# Altium schematic sheet Schematic.SchDoc
size 508 x 330 mm; SheetNumber: 1; SheetTotal: 1
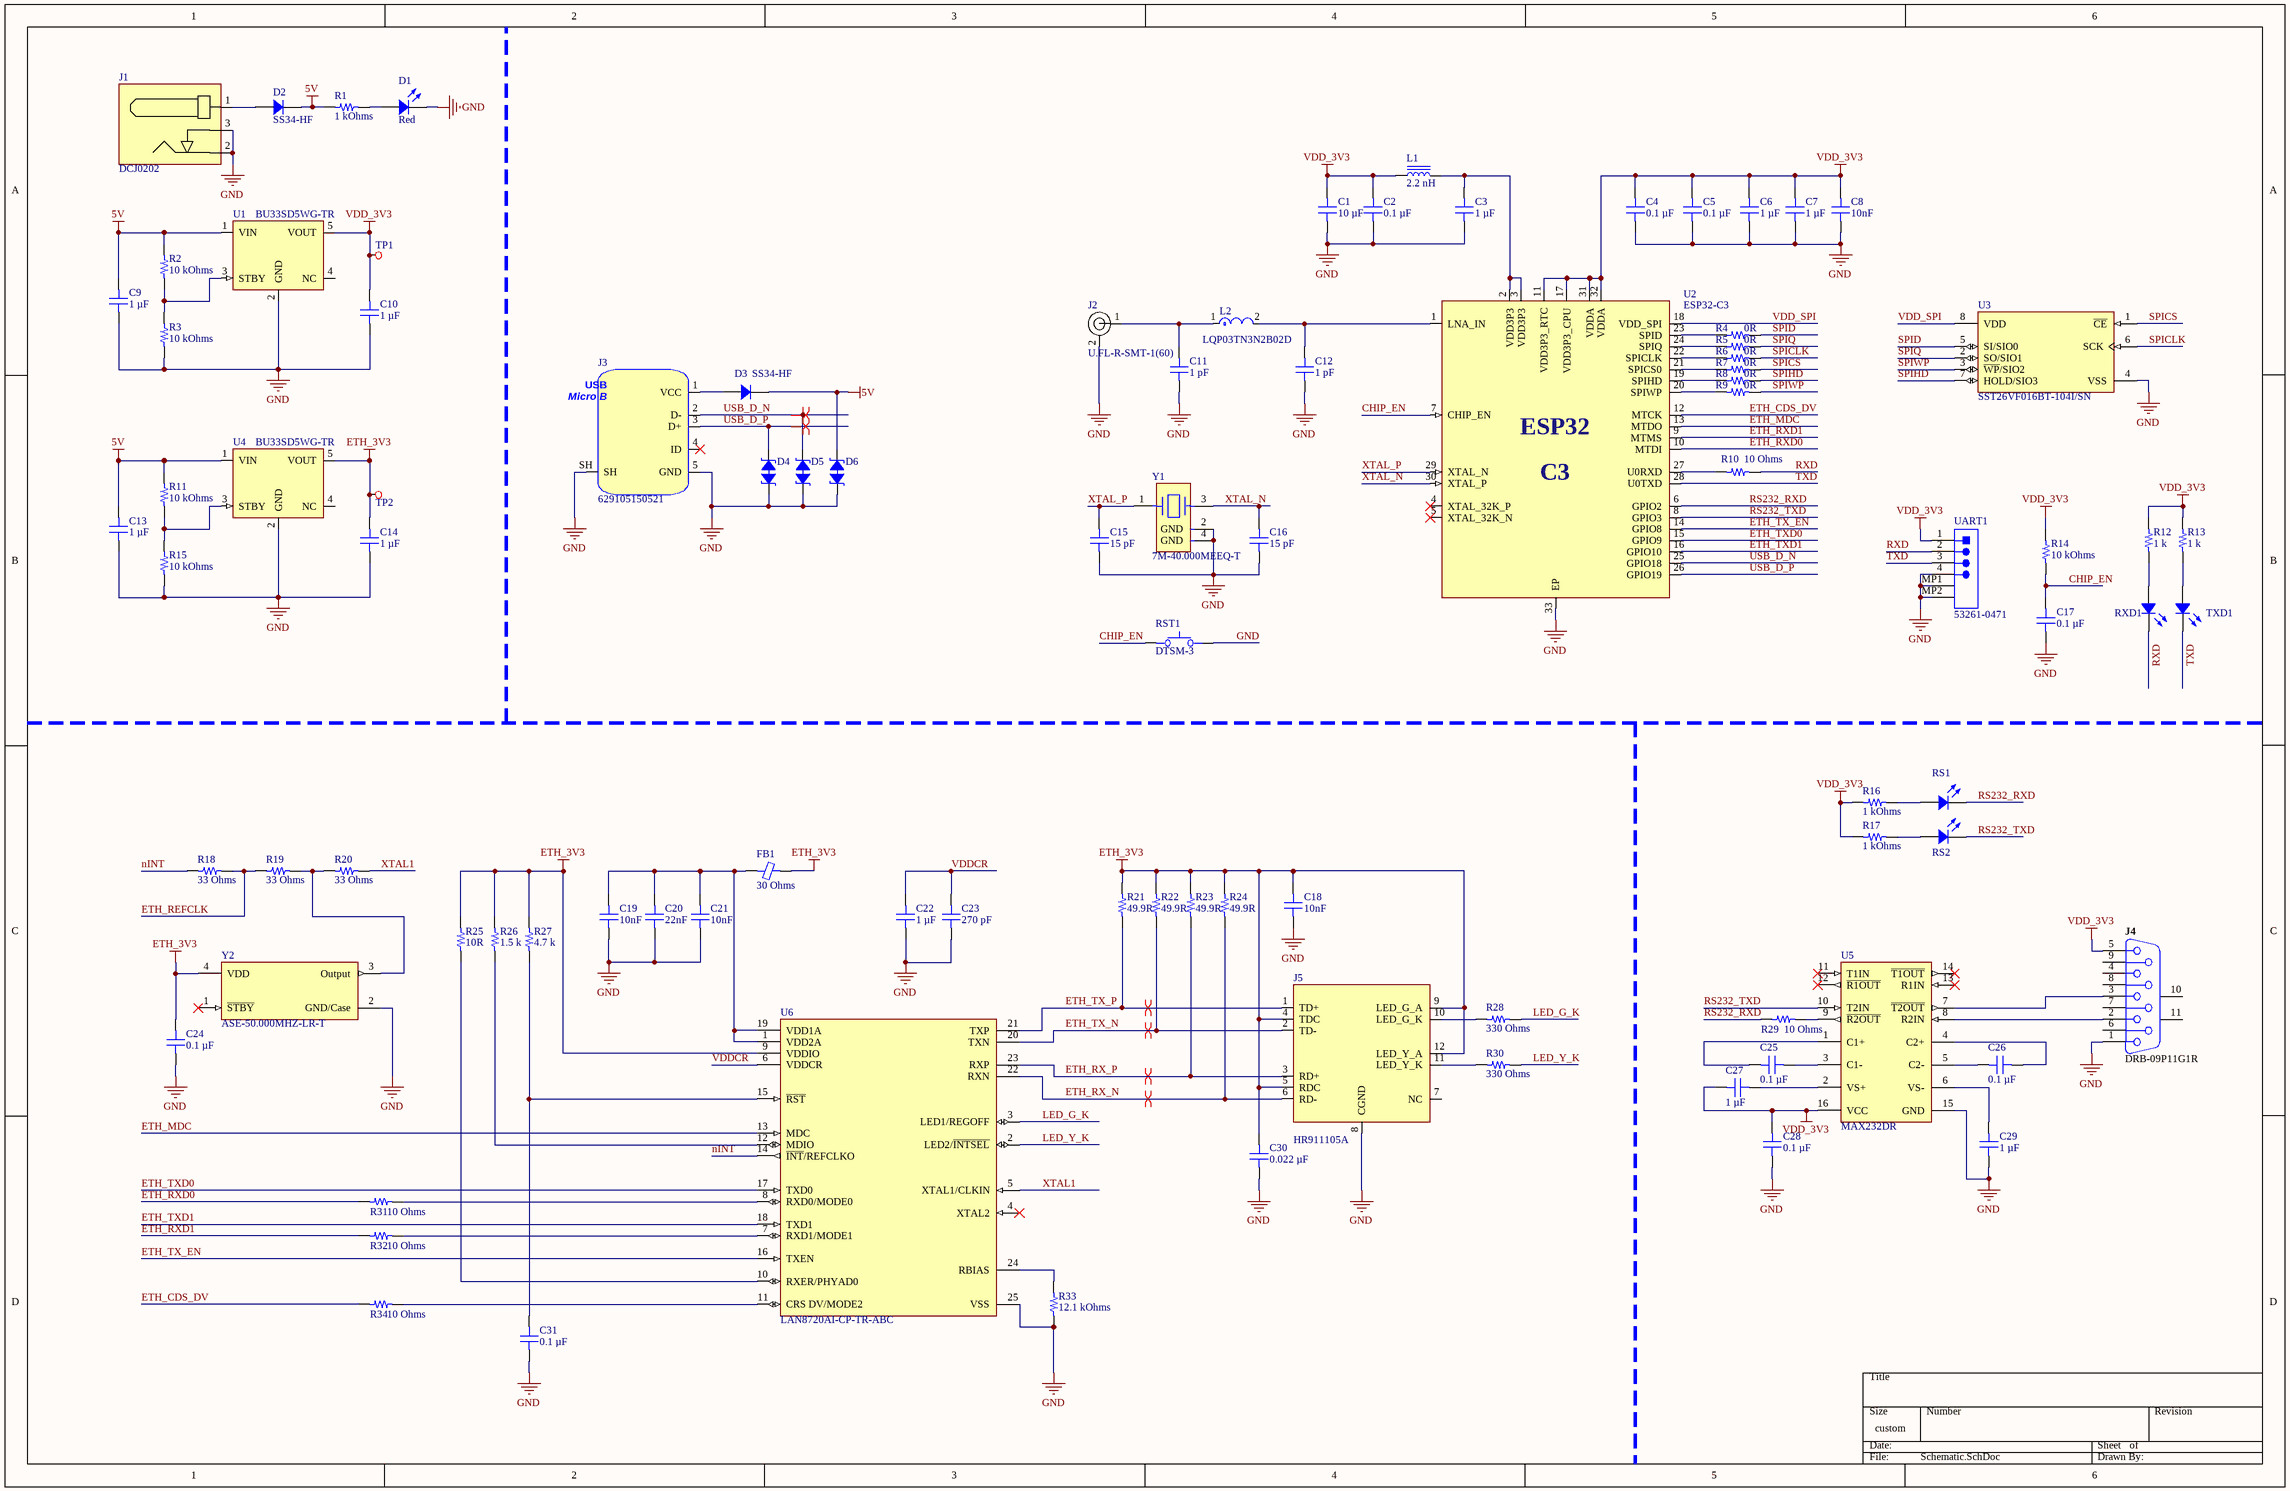
[diagram p0: Schematic.SchDoc]

## Parts
C1  10 µF  [CAP 0402_1005]
C2  0.1 µF  [CAP 0402_1005]
C3  1 µF  [MURATA GRM155 0402_1005]
C4  0.1 µF  [CAP 0402_1005]
C5  0.1 µF  [CAP 0402_1005]
C6  1 µF  [MURATA GRM155 0402_1005]
C7  1 µF  [MURATA GRM155 0402_1005]
C8  Capacitance: 10nF  [CAP 0402_1005]  (hidden comment: 10000 pF)
C9  1 µF  [MURATA GRM155 0402_1005]
C10  1 µF  [MURATA GRM155 0402_1005]
C11  1 pF  [CAP 0201_0603]
C12  1 pF  [CAP 0201_0603]
C13  1 µF  [MURATA GRM155 0402_1005]
C14  1 µF  [MURATA GRM155 0402_1005]
C15  15 pF  [CAP 0402_1005]
C16  15 pF  [CAP 0402_1005]
C17  0.1 µF  [CAP 0402_1005]
C18  Capacitance: 10nF  [CAP 0402_1005]  (hidden comment: 10000 pF)
C19  Capacitance: 10nF  [CAP 0402_1005]  (hidden comment: 10000 pF)
C20  Capacitance: 22nF  [CAP 0402_1005]  (hidden comment: 0.022 µF)
C21  Capacitance: 10nF  [CAP 0402_1005]  (hidden comment: 10000 pF)
C22  1 µF  [MURATA GRM155 0402_1005]
C23  270 pF  [CAP 0402_1005]
C24  0.1 µF  [CAP 0402_1005]
C25  0.1 µF  [CAP 0402_1005]
C26  0.1 µF  [CAP 0402_1005]
C27  1 µF  [MURATA GRM155 0402_1005]
C28  0.1 µF  [CAP 0402_1005]
C29  1 µF  [MURATA GRM155 0402_1005]
C30  0.022 µF  [CAP 0402_1005]
C31  0.1 µF  [CAP 0402_1005]
D1  Red  [LED 0603_1608 RED]
D2  SS34-HF  [DO214AC SMA]
D3  SS34-HF  [DO214AC SMA]
D4  SD05C-TP  [MCC SOD-323]  (value not drawn)
D5  SD05C-TP  [MCC SOD-323]  (value not drawn)
D6  SD05C-TP  [MCC SOD-323]  (value not drawn)
FB1  30 Ohms  [FER 0402_1005]
J1  DCJ0202  [DCJ0202]
J2  U.FL-R-SMT-1(60)  [U.FL-R-SMT-1(60)]
J3  629105150521  [629105150521]
J4  DRB-09P11G1R  [DB9_MALE]
J5  HR911105A  [HR911105A]
L1  2.2 nH  [IND 0402_1005]
L2  LQP03TN3N2B02D  [FP-LQP03TG_02-IPC_B]
R1  1 kOhms  [YAGEO RES 0402_1005]
R2  10 kOhms  [RES 0603_1608]
R3  10 kOhms  [RES 0603_1608]
R4  0R  [RES 0402_1005]
R5  0R  [RES 0402_1005]
R6  0R  [RES 0402_1005]
R7  0R  [RES 0402_1005]
R8  0R  [RES 0402_1005]
R9  0R  [RES 0402_1005]
R10  10 Ohms  [RES 0402_1005]
R11  10 kOhms  [RES 0603_1608]
R12  1 k  [RES 0402_1005]
R13  1 k  [RES 0402_1005]
R14  10 kOhms  [RES 0402_1005]
R15  10 kOhms  [RES 0603_1608]
R16  1 kOhms  [RES 0402_1005]
R17  1 kOhms  [RES 0402_1005]
R18  33 Ohms  [RES 0402_1005]
R19  33 Ohms  [RES 0402_1005]
R20  33 Ohms  [RES 0402_1005]
R21  49.9R  [RES 0402_1005]
R22  49.9R  [RES 0402_1005]
R23  49.9R  [RES 0402_1005]
R24  49.9R  [RES 0402_1005]
R25  10R  [RES 0402_1005]
R26  1.5 k  [RES 0402_1005]
R27  4.7 k  [YAGEO RES 0402_1005]
R28  330 Ohms  [RES 0402_1005]
R29  10 Ohms  [RES 0402_1005]
R30  330 Ohms  [RES 0402_1005]
R31  10 Ohms  [RES 0402_1005]
R32  10 Ohms  [RES 0402_1005]
R33  12.1 kOhms  [RES 0402_1005]
R34  10 Ohms  [RES 0402_1005]
RS1  Green  [LED 0603_1608 GREEN]  (value not drawn)
RS2  Yellow  [LED 0603_1608 YELLOW]  (value not drawn)
RST1  DTSM-3  [DTSM-3]
RXD1  Yellow  [LED 0603_1608 YELLOW]  (value not drawn)
TP1  TEST_POINT_PAD1MM  [ROUND_1MM]  (value not drawn)  (no BOM)
TP2  TEST_POINT_PAD1MM  [ROUND_1MM]  (value not drawn)  (no BOM)
TXD1  Green  [LED 0603_1608 GREEN]  (value not drawn)
U1  BU33SD5WG-TR  [SOT-23-5]
U2  ESP32-C3  [QFN32-5x5]
U3  SST26VF016BT-104I/SN  [FP-C04-057-SN-IPC_B]
U4  BU33SD5WG-TR  [SOT-23-5]
U5  MAX232DR  [D0016A_N]
U6  LAN8720AI-CP-TR-ABC  [FP-24-S4QFN-4x4B-0_5P-IPC_C]
UART1  53261-0471  [MOLEX-53261-0471_V]
Y1  7M-40.000MEEQ-T  [FP-7M-MFG]
Y2  ASE-50.000MHZ-LR-T  [FP-ASE-MFG]

## Nets
5V: C9.2 C13.2 D2.2 D3.2 D6.2 R1.1 R2.2 R11.2 U1.1(VIN) U4.1(VIN)
ETH_3V3: C14.2 C18.2 C24.2 C30.2 FB1.2 J5.4(TDC) J5.5(RDC) J5.9(LED_G_A) J5.12(LED_Y_A) R21.2 R22.2 R23.2 R24.2 R25.2 R26.2 R27.2 TP2.1 U4.5(VOUT) U6.9(VDDIO) Y2.4(VDD)
GND: C1.1 C2.1 C3.1 C4.1 C5.1 C6.1 C7.1 C8.1 C9.1 C10.1 C11.1 C12.1 C13.1 C14.1 C15.1 C16.1 C17.1 C18.1 C19.1 C20.1 C21.1 C22.1 C23.1 C24.1 C28.2 C29.2 C30.1 C31.1 D1.2 D4.1 D5.1 D6.1 J1.2 J1.3 J2.2 J3.5(GND) J3.SH J4.1 J5.8(CGND) R3.1 R15.1 R33.1 RST1.2 U1.2(GND) U2.33(EP) U3.4(VSS) U4.2(GND) U5.15(GND) U6.25(VSS) UART1.4 UART1.MP1 UART1.MP2 Y1.2(GND) Y1.4(GND) Y2.2(GND/Case)
VDD_3V3: C1.2 C2.2 C4.2 C5.2 C6.2 C7.2 C8.2 C10.2 C27.2 C28.1 J4.5 L1.1 R12.1 R13.1 R14.2 R16.1 R17.1 TP1.1 U1.5(VOUT) U2.11(VDD3P3_RTC) U2.17(VDD3P3_CPU) U2.31(VDDA) U2.32(VDDA) U5.16(VCC) UART1.1
CHIP_EN: C17.2 R14.1 RST1.1 U2.7(CHIP_EN)
ETH_CDS_DV: R34.1 U2.12(MTCK)
ETH_MDC: U2.13(MTDO) U6.13(MDC)
ETH_REFCLK: R18.2 R19.1
ETH_RX_N: J5.6(RD-) R24.1 U6.22(RXN)
ETH_RX_P: J5.3(RD+) R23.1 U6.23(RXP)
ETH_RXD0: R31.1 U2.10(MTDI)
ETH_RXD1: R32.1 U2.9(MTMS)
ETH_TX_EN: U2.14(GPIO8) U6.16(TXEN)
ETH_TX_N: J5.2(TD-) R22.1 U6.20(TXN)
ETH_TX_P: J5.1(TD+) R21.1 U6.21(TXP)
ETH_TXD0: U2.15(GPIO9) U6.17(TXD0)
ETH_TXD1: U2.16(GPIO10) U6.18(TXD1)
LED_G_K: R28.2 U6.3(LED1/REGOFF)
LED_Y_K: R30.2 U6.2(LED2/~{INTSEL})
nINT: R18.1 U6.14(~{INT}/REFCLKO)
RS232_RXD: R29.1 RS1.2 U2.6(GPIO2)
RS232_TXD: RS2.2 U2.8(GPIO3) U5.10(T2IN)
RXD: R10.2 RXD1.2 UART1.2
SPICLK: R6.2 U3.6(SCK)
SPICS: R7.2 U3.1(~{CE})
SPID: R4.2 U3.5(SI/SIO0)
SPIHD: R8.2 U3.7(HOLD/SIO3)
SPIQ: R5.2 U3.2(SO/SIO1)
SPIWP: R9.2 U3.3(~{WP}/SIO2)
TXD: TXD1.2 U2.28(U0TXD) UART1.3
USB_D_N: D5.2 J3.2(D-) U2.25(GPIO18)
USB_D_P: D4.2 J3.3(D+) U2.26(GPIO19)
VDD_SPI: U2.18(VDD_SPI) U3.8(VDD)
VDDCR: C22.2 C23.2 U6.6(VDDCR)
XTAL1: R20.2 U6.5(XTAL1/CLKIN)
XTAL_N: C16.2 U2.30(XTAL_P) Y1.3
XTAL_P: C15.2 U2.29(XTAL_N) Y1.1
NetC3_2: C3.2 L1.2 U2.2(VDD3P3) U2.3(VDD3P3)
NetC11_2: C11.2 J2.1 L2.1
NetC12_2: C12.2 L2.2 U2.1(LNA_IN)
NetC19_2: C19.2 C20.2 C21.2 FB1.1 U6.1(VDD2A) U6.19(VDD1A)
NetC25_1: C25.1 U5.3(C1-)
NetC25_2: C25.2 U5.1(C1+)
NetC26_1: C26.1 U5.4(C2+)
NetC26_2: C26.2 U5.5(C2-)
NetC27_1: C27.1 U5.2(VS+)
NetC29_1: C29.1 U5.6(VS-)
NetC31_2: C31.2 R27.1 U6.15(~{RST})
NetD1_1: D1.1 R1.2
NetD2_1: D2.1 J1.1
NetD3_1: D3.1 J3.1(VCC)
NetJ4_2: J4.2 U5.8(R2IN)
NetJ4_3: J4.3 U5.7(~{T2OUT})
NetJ5_10: J5.10(LED_G_K) R28.1
NetJ5_11: J5.11(LED_Y_K) R30.1
NetR2_1: R2.1 R3.2 U1.3(STBY)
NetR4_1: R4.1 U2.23(SPID)
NetR5_1: R5.1 U2.24(SPIQ)
NetR6_1: R6.1 U2.22(SPICLK)
NetR7_1: R7.1 U2.21(SPICS0)
NetR8_1: R8.1 U2.19(SPIHD)
NetR9_1: R9.1 U2.20(SPIWP)
NetR10_1: R10.1 U2.27(U0RXD)
NetR11_1: R11.1 R15.2 U4.3(STBY)
NetR12_2: R12.2 RXD1.1
NetR13_2: R13.2 TXD1.1
NetR16_2: R16.2 RS1.1
NetR17_2: R17.2 RS2.1
NetR19_2: R19.2 R20.1 Y2.3(Output)
NetR25_1: R25.1 U6.10(RXER/PHYAD0)
NetR26_1: R26.1 U6.12(MDIO)
NetR29_2: R29.2 U5.9(~{R2OUT})
NetR31_2: R31.2 U6.8(RXD0/MODE0)
NetR32_2: R32.2 U6.7(RXD1/MODE1)
NetR33_2: R33.2 U6.24(RBIAS)
NetR34_2: R34.2 U6.11(CRS_DV/MODE2)

Not connected (* = marked no-connect by the designer): J3 4(ID)*; J4 4 6 7 8 9 10(MH1) 11(MH2); J5 7(NC); U1 4(NC); U2 4(XTAL_32K_P)* 5(XTAL_32K_N)*; U4 4(NC); U5 11(T1IN)* 12(~{R1OUT})* 13(R1IN)* 14(~{T1OUT})*; U6 4(XTAL2)*; Y2 1(~{STBY})*

## Layout directives
differential pair; differential pair class DIFF100: ETH_RX_N, ETH_RX_P, ETH_TX_N, ETH_TX_P
differential pair; differential pair class DIFF90: USB_D_N, USB_D_P

## Notes on the sheet
- (in symbol 629105150521) USB; Micro B
- (in symbol ESP32-C3) ESP32; C3

## Library data of the parts
C1 = CL05A106MP5NUNC: CAP CER 10UF 10V X5R 0402; manufacturer: Samsung Electro-Mechanics; Tolerance: ±20%; Part Number: CL05A106MP5NUNC; Capacitance: 10 µF; Applications: General Purpose; componentlink1description: Datasheet; componentlink1url: http://www.samsungsem.com/kr/support/product-search/mlcc/CL05A106MP5NUNC.jsp; componentlink2description: DigiKey Link; componentlink2url: https://www.digikey.com/en/products/detail/samsung-electro-mechanics/CL05A106MP5NUNC/3887108; Device Package: 0402 (1005 Metric); lastupdated: 2/9/2024 8:04:38 PM; Lifecycle Status: Active; Minimum Order: 1; Mounting Type: Surface Mount, MLCC; Operating Temperature: -55°C ~ 85°C; Package / Case: 0402 (1005 Metric); packaging: TapeAndReel; partid: 1762; Part Status: Active; price: 0.02; series: CL; Size / Dimension: 0.039" L x 0.020" W (1.00mm x 0.50mm); Supplier 1: DigiKey; Supplier Part Number 1: 1276-1450-1-ND; Temperature Coefficient: X5R; Thickness (Max): 0.028" (0.70mm); value: 10 µF; Voltage - Rated: 10V
C2 C4 C5 C17 C24-C26 C28 C31 = CC0402MRX5R5BB104: CAP CER 0.1UF 6.3V X5R 0402; manufacturer: Yageo; Tolerance: ±20%; Part Number: CC0402MRX5R5BB104; Capacitance: 0.1 µF; Applications: General Purpose; componentlink1description: Datasheet; componentlink1url: https://www.yageo.com/upload/media/product/productsearch/datasheet/mlcc/UPY-GPHC_X5R_4V-to-50V_25.pdf; componentlink2description: DigiKey Link; componentlink2url: https://www.digikey.com/en/products/detail/yageo/CC0402MRX5R5BB104/5883384; Device Package: 0402 (1005 Metric); lastupdated: 2/9/2024 8:04:37 PM; Lifecycle Status: Active; Minimum Order: 10; Mounting Type: Surface Mount, MLCC; Operating Temperature: -55°C ~ 85°C; Package / Case: 0402 (1005 Metric); packaging: CutTape; partid: 1960; Part Status: Active; price: 0.01; series: CC; Size / Dimension: 0.039" L x 0.020" W (1.00mm x 0.50mm); Supplier 1: DigiKey; Supplier Part Number 1: 311-3818-1-ND; Temperature Coefficient: X5R; Thickness (Max): 0.022" (0.55mm); value: 0.1 µF; Voltage - Rated: 6.3V
C3 C6 C7 C9 C10 C13 C14 C22 C27 C29 = GRM155C71A105KE11D: CAP CER 1UF 10V X7S 0402; manufacturer: Murata Electronics; Tolerance: ±10%; Part Number: GRM155C71A105KE11D; Capacitance: 1 µF; Applications: General Purpose; componentlink1description: Datasheet; componentlink1url: https://search.murata.co.jp/Ceramy/image/img/A01X/G101/ENG/GRM155C71A105KE11-01.pdf; componentlink2description: DigiKey Link; componentlink2url: https://www.digikey.com/en/products/detail/murata-electronics/GRM155C71A105KE11D/6606086; Device Package: 0402 (1005 Metric); lastupdated: 8/27/2024 12:42:54 PM; Lifecycle Status: Active; Minimum Order: 1; Mounting Type: Surface Mount, MLCC; Operating Temperature: -55°C ~ 125°C; Package / Case: 0402 (1005 Metric); packaging: TapeAndReel; partid: 1749; Part Status: Active; price: 0.01; series: GRM; Size / Dimension: 0.039" L x 0.020" W (1.00mm x 0.50mm); Supplier 1: DigiKey; Supplier Part Number 1: 490-14457-1-ND; Temperature Coefficient: X7S; Thickness (Max): 0.024" (0.60mm); value: 1 µF; Voltage - Rated: 10V
C8 C18 C19 C21 = C0402C103M5RECAUTO: CAP CER 0402 10NF 50V X7R 20%; manufacturer: KEMET; Part Number: C0402C103M5RECAUTO; Applications: Automotive, ESD Protection; componentlink1description: Datasheet; componentlink1url: https://api.kemet.com/component-edge/download/datasheet/C0402C103M5RECAUTO.pdf; componentlink2description: DigiKey Link; componentlink2url: https://www.digikey.com/en/products/detail/kemet/C0402C103M5RECAUTO/8646509; Device Package: 0402 (1005 Metric); lastupdated: 2/9/2024 8:04:13 PM; Lifecycle Status: Active; Minimum Order: 1; Mounting Type: Surface Mount, MLCC; Operating Temperature: -55°C ~ 125°C; Package / Case: 0402 (1005 Metric); packaging: TapeAndReel; partid: 33125; Part Status: Active; price: 0.01; Ratings: AEC-Q200; series: ESD SMD Auto X7R; Size / Dimension: 0.039" L x 0.020" W (1.00mm x 0.50mm); Supplier 1: DigiKey; Supplier Part Number 1: 399-C0402C103M5RECAUTOCT-ND; Temperature Coefficient: X7R; Thickness (Max): 0.022" (0.55mm); Tolerance: ±20%; value: 10000 pF; Voltage - Rated: 50V
C11 C12 = 0201N1R0C500CT: CAP CER 1PF 50V C0G/NP0 0201; manufacturer: Walsin Technology Corporation; Temperature Coefficient: C0G, NP0; Tolerance: ±0.25pF; Part Number: 0201N1R0C500CT; Capacitance: 1 pF; Applications: General Purpose; componentlink1description: Datasheet; componentlink1url: http://www.passivecomponent.com/wp-content/uploads/2018/10/MLCC.pdf; componentlink2description: DigiKey Link; componentlink2url: https://www.digikey.com/en/products/detail/walsin-technology-corporation/0201N1R0C500CT/9354642; Device Package: 0201 (0603 Metric); lastupdated: 6/4/2024 7:01:11 PM; Lifecycle Status: Active; Minimum Order: 1; Mounting Type: Surface Mount, MLCC; Operating Temperature: -55°C ~ 125°C; Package / Case: 0201 (0603 Metric); packaging: CutTape; partid: 34; Part Status: Active; price: 0.01; series: -; Size / Dimension: 0.024" L x 0.012" W (0.60mm x 0.30mm); Supplier 1: DigiKey; Supplier Part Number 1: 1292-1144-1-ND; Thickness (Max): 0.013" (0.33mm); value: 1 pF; Voltage - Rated: 50V
C15 C16 = CBR04C150J5GAC: CAP CER 15PF 50V C0G/NP0 0402; manufacturer: KEMET; Temperature Coefficient: C0G, NP0; Tolerance: ±5%; Part Number: CBR04C150J5GAC; Capacitance: 15 pF; Applications: RF, Microwave, High Frequency; componentlink1description: Datasheet; componentlink1url: https://api.kemet.com/component-edge/download/datasheet/CBR04C150J5GAC.pdf; componentlink2description: DigiKey Link; componentlink2url: https://www.digikey.com/en/products/detail/kemet/CBR04C150J5GAC/2732287; Device Package: 0402 (1005 Metric); Features: High Q, Low Loss, Ultra Low ESR; lastupdated: 2/9/2024 8:04:38 PM; Lifecycle Status: Active; Minimum Order: 1; Mounting Type: Surface Mount, MLCC; Operating Temperature: -55°C ~ 125°C; Package / Case: 0402 (1005 Metric); packaging: TapeAndReel; partid: 1728; Part Status: Active; price: 0.02; series: CBR-SMD RF C0G; Size / Dimension: 0.039" L x 0.020" W (1.00mm x 0.50mm); Supplier 1: DigiKey; Supplier Part Number 1: 399-6170-1-ND; Thickness (Max): 0.022" (0.55mm); value: 15 pF; Voltage - Rated: 50V
C20 = C0402C223K5RECAUTO: CAP CER 0402 22NF 50V X7R 10%; manufacturer: KEMET; Part Number: C0402C223K5RECAUTO; Applications: Automotive, ESD Protection; componentlink1description: Datasheet; componentlink1url: https://api.kemet.com/component-edge/download/datasheet/C0402C223K5RECAUTO.pdf; componentlink2description: DigiKey Link; componentlink2url: https://www.digikey.com/en/products/detail/kemet/C0402C223K5RECAUTO/8563694; Device Package: 0402 (1005 Metric); lastupdated: 2/9/2024 8:04:38 PM; Lifecycle Status: Active; Minimum Order: 1; Mounting Type: Surface Mount, MLCC; Operating Temperature: -55°C ~ 125°C; Package / Case: 0402 (1005 Metric); packaging: TapeAndReel; partid: 1729; Part Status: Active; price: 0.01; Ratings: AEC-Q200; series: ESD SMD Auto X7R; Size / Dimension: 0.039" L x 0.020" W (1.00mm x 0.50mm); Supplier 1: DigiKey; Supplier Part Number 1: 399-17166-1-ND; Temperature Coefficient: X7R; Thickness (Max): 0.022" (0.55mm); Tolerance: ±10%; value: 0.022 µF; Voltage - Rated: 50V
C23 = C0402C271J5GAC7867: CAP CER 270PF 50V C0G/NP0 0402; manufacturer: KEMET; Temperature Coefficient: C0G, NP0; Tolerance: ±5%; Part Number: C0402C271J5GAC7867; Capacitance: 270 pF; Applications: General Purpose; componentlink1description: Datasheet; componentlink1url: https://api.kemet.com/component-edge/download/datasheet/C0402C271J5GAC7867.pdf; componentlink2description: DigiKey Link; componentlink2url: https://www.digikey.com/en/products/detail/kemet/C0402C271J5GAC7867/2269192; Device Package: 0402 (1005 Metric); Features: Low ESL; lastupdated: 2/9/2024 8:04:37 PM; Lifecycle Status: Active; Minimum Order: 1; Mounting Type: Surface Mount, MLCC; Operating Temperature: -55°C ~ 125°C; Package / Case: 0402 (1005 Metric); packaging: TapeAndReel; partid: 1905; Part Status: Active; price: 0.01; series: SMD Comm C0G; Size / Dimension: 0.039" L x 0.020" W (1.00mm x 0.50mm); Supplier 1: DigiKey; Supplier Part Number 1: 399-8961-1-ND; Thickness (Max): 0.022" (0.55mm); value: 270 pF; Voltage - Rated: 50V
C30 = 0402BB223K500NGT: CAP CER 0.022UF 50V X7R 0402; manufacturer: Knowles Novacap; Tolerance: ±10%; Part Number: 0402BB223K500NGT; Capacitance: 0.022 µF; Applications: General Purpose; componentlink1description: Datasheet; componentlink1url: https://www.knowlescapacitors.com/getattachment/6c8d48ef-fc2b-4752-ae2c-ce6c208de0c4/High-Capacitance-Chip.aspx; componentlink2description: DigiKey Link; componentlink2url: https://www.digikey.com/en/products/detail/knowles-novacap/0402BB223K500NGT/7304111; Device Package: 0402 (1005 Metric); Features: Gold Flash Termination; lastupdated: 2/9/2024 8:04:38 PM; Lifecycle Status: Active; Minimum Order: 1; Mounting Type: Surface Mount, MLCC; Operating Temperature: -55°C ~ 125°C; Package / Case: 0402 (1005 Metric); packaging: TapeAndReel; partid: 1717; Part Status: Active; price: 1.15; series: -; Size / Dimension: 0.040" L x 0.020" W (1.02mm x 0.51mm); Supplier 1: DigiKey; Supplier Part Number 1: 1763-1160-1-ND; Temperature Coefficient: X7R; Thickness (Max): 0.024" (0.61mm); value: 0.022 µF; Voltage - Rated: 50V
D1 = HSMC-C020: LED RED 0603 SMD; Manufacturer: Broadcom Limited; Current - Test: 20mA; Lens Size: 1.60mm x 0.80mm; Lens Style: Rectangle with Flat Top; Millicandela Rating: 28.5mcd; Viewing Angle: 140°; Voltage - Forward (Vf) (Typ): 2V; Wavelength - Dominant: 625nm; Wavelength - Peak: 634nm; Part Number: HSMC-C020; Color: Red; ComponentLink1Description: Datasheet; ComponentLink1URL: https://docs.broadcom.com/docs/HSMC-C020-Mono-Color-Top-Mount-ChipLED-DS; ComponentLink2Description: DigiKey Link; ComponentLink2URL: https://www.digikey.com/en/products/detail/broadcom-limited/HSMC-C020/17967949; Device Package: 0603 (1608 Metric); Height (Max): 0.30mm; LastUpdated: 6/3/2024 7:59:39 PM; Lifecycle Status: Active; Minimum Order: 1; Mounting Type: Surface Mount; Package / Case: 0603 (1608 Metric); Packaging: TapeAndReel; PartId: 1346; Part Status: Active; Price: 0.31; Series: -; Size / Dimension: 1.60mm L x 0.80mm W; Supplier 1: DigiKey; Supplier Part Number 1: 516-HSMC-C020CT-ND; Supplier Device Package: 0603; Value: Red
D2 D3 = SS34-HF: DIODE SCHOTTKY 40V 3A DO214AC; Manufacturer: Comchip Technology; Capacitance @ Vr, F: 450pF @ 4V, 1MHz; Current - Reverse Leakage @ Vr: 500 µA @ 40 V; Speed: Fast Recovery =< 500ns, > 200mA (Io); Voltage - Forward (Vf) (Max) @ If: 550 mV @ 3 A; Part Number: SS34-HF; ComponentLink1Description: Datasheet; ComponentLink1URL: http://www.comchiptech.com/admin/files/product/20190514101641.pdf; ComponentLink2Description: DigiKey Link; ComponentLink2URL: https://www.digikey.com/en/products/detail/comchip-technology/SS34-HF/10279693; Current - Average Rectified (Io): 3A; Diode Type: Schottky; LastUpdated: 6/3/2024 7:54:30 PM; Lifecycle Status: Active; Minimum Order: 1; Mounting Type: Surface Mount; Operating Temperature - Junction: -55°C ~ 125°C; Package / Case: DO-214AC, SMA; Packaging: TapeAndReel; PartId: 2138; Part Status: Active; Price: 0.07; Series: -; Supplier 1: DigiKey; Supplier Part Number 1: 641-2115-1-ND; Supplier Device Package: DO-214AC (SMA); Voltage - DC Reverse (Vr) (Max): 40 V
D4-D6 = SD05C-TP: 5V,ESD PROTECTION DEVICES,SOD-32; Manufacturer: Micro Commercial Co; Bidirectional Channels: 1; Capacitance @ Frequency: 125pF @ 1MHz; Current - Peak Pulse (10/1000µs): 24A (8/20µs); Power Line Protection: No; Power - Peak Pulse: 350W; Type: Zener; Voltage - Breakdown (Min): 6V; Voltage - Clamping (Max) @ Ipp: 13.5V; Voltage - Reverse Standoff (Typ): 5V (Max); Part Number: SD05C-TP; Applications: General Purpose; ComponentLink1Description: Datasheet; ComponentLink1URL: https://www.mccsemi.com/pdf/Products/SD05C(SOD-323)-C.pdf; ComponentLink2Description: DigiKey Link; ComponentLink2URL: http://digikey.com/product-detail/en/micro-commercial-co/SD05C-TP/SD05C-TPMSCT-ND/8554544; LastUpdated: 10/13/2024 8:18:45 AM; Lifecycle Status: Active; Minimum Order: 1; Mounting Type: Surface Mount; Operating Temperature: -55°C ~ 150°C (TJ); Package / Case: SC-76, SOD-323; Packaging: TapeAndReel; PartId: 9978; Part Status: Active; Price: 0.08; Series: -; Supplier 1: DigiKey; Supplier Part Number 1: SD05C-TPMSCT-ND; Supplier Device Package: SOD-323
FB1 = BLM15KD300SN1D: FERRITE BEAD 30 OHM 0402 1LN; Manufacturer: Murata Electronics; Current Rating (Max): 3.1A; DC Resistance (DCR) (Max): 17mOhm; Filter Type: Signal Line; Impedance @ Frequency: 30 Ohms @ 100 MHz; Number of Lines: 1; Part Number: BLM15KD300SN1D; ComponentLink1Description: Datasheet; ComponentLink1URL: https://www.murata.com/en-us/products/productdata/8796740059166/ENFA0018.pdf; ComponentLink2Description: DigiKey Link; ComponentLink2URL: https://www.digikey.com/en/products/detail/murata-electronics/BLM15KD300SN1D/6798442; Device Package: 0402 (1005 Metric); Height (Max): 0.022" (0.55mm); LastUpdated: 6/3/2024 7:51:06 PM; Lifecycle Status: Active; Minimum Order: 1; Mounting Type: Surface Mount; Operating Temperature: -55°C ~ 125°C; Package / Case: 0402 (1005 Metric); Packaging: TapeAndReel; PartId: 195; Part Status: Active; Price: 0.02; Series: BLM; Size / Dimension: 0.039" L x 0.022" W (1.00mm x 0.55mm); Supplier 1: DigiKey; Supplier Part Number 1: 490-15017-1-ND; Value: 30 Ohms
J1 = DCJ0202: DC Barrell Jack 2.1mm 24V 5A THT; Manufacturer: CONEC; Manufacturer Part Number: DCJ0202
J2 = U.FL-R-SMT-1(60): RF Connector u.FL 50 Ohms 6 GHz; Manufacturer: Hirose Connector; Manufacturer Part Number: U.FL-R-SMT-1(60)
J3 = 629105150521: USB Connector Type Micro B 2.0 SMD; Manufacturer: Wurth; Manufacturer Part Number: 629105150521; Distributor Link: https://www.mouser.de/ProductDetail/Wurth-Elektronik/629105150521?qs=a9WhcLg8qCzXiH7kZP8GRQ%3D%3D
J4 = CON 9 Male: Connector, DB9 R/A Through-hole Male; Connector type: Header; Max Current: 3A; Mounting Technology: Through-Hole; Pin Count: 9; Status: Unreleased; Category: Connector
J5 = HR911105A: Single Port RJ45 Connector w/ Integrated Magnetic and LED 10/100 Base-T; Manufacturer: HanRun; Manufacturer Part Number: HR911105A
L1 = 0402HS-2N2EJTS: FIXED IND 2.2NH 960MA 70MOHM SMD; Manufacturer: Delta Electronics/Components; Frequency - Self Resonant: 10.8GHz; Inductance Frequency - Test: 250 MHz; Material - Core: Ceramic; Q @ Freq: 19 @ 250MHz; Shielding: Unshielded; Tolerance: ±5%; Type: Drum Core, Wirewound; Part Number: 0402HS-2N2EJTS; ComponentLink1Description: Datasheet; ComponentLink1URL: https://www.deltaww.com/filecenter/Products/download/04/0402/0402HS.pdf; ComponentLink2Description: DigiKey Link; ComponentLink2URL: https://www.digikey.com/en/products/detail/delta-electronics-components/0402HS-2N2EJTS/9762678; Current Rating (Amps): 960 mA; DC Resistance (DCR): 70mOhm; Device Package: 0402 (1005 Metric); Height - Seated (Max): 0.024" (0.60mm); Inductance: 2.2 nH; LastUpdated: 6/3/2024 8:12:49 PM; Lifecycle Status: Active; Minimum Order: 1; Mounting Type: Surface Mount; Operating Temperature: -40°C ~ 125°C; Package / Case: 0402 (1005 Metric); Packaging: TapeAndReel; PartId: 4387; Part Status: Active; Price: 0.08; Series: 0402HS; Size / Dimension: 0.050" L x 0.030" W (1.27mm x 0.76mm); Supplier 1: DigiKey; Supplier Part Number 1: 2035-1011-1-ND; Supplier Device Package: 0402; Value: 2.2 nH
L2 = CMP-06042-010142-1: Film type RF Inductor 3.2nH ±0.1nH 450mA 0.25Ω 0201 (0603); DC Resistance (DCR): 250mR; Shielding: Unshielded; Test Frequency: 500MHz; Core Material: Non-Magnetic; Q Factor: 14; Self Resonant Frequency: 8GHz; Resistor Type: Thin Film; Military Standard: Not; Mount: Surface Mount; Termination: SMD/SMT; Current Rating: 450mA; Packaging: Tape and Reel; Min Operating Temperature: -55°C; Case Code (Imperial): 0201; Case Code (Metric): 0603; Inductance: 3.2nH; Width: 0.012inch; Depth: 0.33mm; Max Operating Temperature: 125°C; Length: 0.024inch; Package Quantity: 15000; Case/Package: 0201; DC Current: 450mA; Max DC Current: 450mA; Height: 0.3mm; Height - Seated (Max): 0.013inch
R1 = AT0402BRD071KL: RES SMD 1K OHM 0.1% 1/16W 0402; Manufacturer: Yageo; Power (Watts): 0.063W, 1/16W; Temperature Coefficient: ±25ppm/°C; Part Number: AT0402BRD071KL; Value: 1 kOhms; ComponentLink1Description: Datasheet; ComponentLink1URL: http://www.yageo.com/documents/recent/PYu-AT_51_RoHS_L_5.pdf; ComponentLink2Description: DigiKey Link; ComponentLink2URL: https://www.digikey.com/en/products/detail/yageo/AT0402BRD071KL/5138607; Composition: Thin Film; Device Package: 0402 (1005 Metric); Features: Anti-Sulfur, Automotive AEC-Q200, Moisture Resistant; Height - Seated (Max): 0.014" (0.35mm); LastUpdated: 7/25/2024 9:18:19 AM; Lifecycle Status: Active; Minimum Order: 1; Number of Terminations: 2; Operating Temperature: -55°C ~ 155°C; Package / Case: 0402 (1005 Metric); Packaging: TapeAndReel; PartId: 2462; Part Status: Active; Price: 0.08; Ratings: AEC-Q200; Resistance: 1 kOhms; Series: AT; Size / Dimension: 0.039" L x 0.020" W (1.00mm x 0.50mm); Supplier 1: DigiKey; Supplier Part Number 1: YAG2088CT-ND; Supplier Device Package: 0402; Tolerance: ±0.1%
R2 R3 R11 R15 = RNCS0603BKE10K0: RES 10K OHM 0.1% 1/16W 0603; Manufacturer: Stackpole Electronics Inc; Power (Watts): 0.063W, 1/16W; Temperature Coefficient: ±25ppm/°C; Part Number: RNCS0603BKE10K0; Value: 10 kOhms; ComponentLink1Description: Datasheet; ComponentLink1URL: https://www.seielect.com/catalog/sei-rncs_rnch.pdf; ComponentLink2Description: DigiKey Link; ComponentLink2URL: https://www.digikey.com/en/products/detail/stackpole-electronics-inc/RNCS0603BKE10K0/1708836; Composition: Thin Film; Device Package: 0603 (1608 Metric); Features: Anti-Corrosive, Automotive AEC-Q200, Moisture Resistant; Height - Seated (Max): 0.022" (0.55mm); LastUpdated: 2/9/2024 8:43:37 PM; Lifecycle Status: Active; Minimum Order: 1; Number of Terminations: 2; Operating Temperature: -55°C ~ 155°C; Package / Case: 0603 (1608 Metric); Packaging: TapeAndReel; PartId: 4838; Part Status: Active; Price: 0.06; Ratings: AEC-Q200; Resistance: 10 kOhms; Series: RNCS; Size / Dimension: 0.061" L x 0.031" W (1.55mm x 0.80mm); Supplier 1: DigiKey; Supplier Part Number 1: RNCS0603BKE10K0CT-ND; Supplier Device Package: 0603; Tolerance: ±0.1%
R4-R9 = CRCW04020000Z0EDHP: RES SMD 0 OHM JUMPER 1/5W 0402; Manufacturer: Vishay Dale; Power (Watts): 0.2W, 1/5W; Resistance: 0 Ohms; Part Number: CRCW04020000Z0EDHP; Value: 0R; ComponentLink1Description: Datasheet; ComponentLink1URL: http://www.vishay.com/docs/20043/crcwhpe3.pdf; ComponentLink2Description: DigiKey Link; ComponentLink2URL: https://www.digikey.com/en/products/detail/vishay-dale/CRCW04020000Z0EDHP/2222496; Composition: Thick Film; Device Package: 0402 (1005 Metric); Features: Automotive AEC-Q200, Pulse Withstanding; Height - Seated (Max): 0.016" (0.40mm); LastUpdated: 2/9/2024 8:30:21 PM; Lifecycle Status: Active; Minimum Order: 1; Number of Terminations: 2; Operating Temperature: -55°C ~ 155°C; Package / Case: 0402 (1005 Metric); Packaging: TapeAndReel; PartId: 3131; Part Status: Active; Price: 0.01; Ratings: AEC-Q200; Series: CRCW-HP; Size / Dimension: 0.039" L x 0.020" W (1.00mm x 0.50mm); Supplier 1: DigiKey; Supplier Part Number 1: 541-0.0YBCT-ND; Supplier Device Package: 0402; Tolerance: Jumper
R10 R29 R31 R32 R34 = RR0510R-100-D: RES SMD 10 OHM 0.5% 1/16W 0402; Manufacturer: Susumu; Power (Watts): 0.063W, 1/16W; Temperature Coefficient: ±100ppm/°C; Part Number: RR0510R-100-D; Value: 10 Ohms; ComponentLink1Description: Datasheet; ComponentLink1URL: http://www.susumu.co.jp/common/pdf/n_catalog_partition05_en.pdf; ComponentLink2Description: DigiKey Link; ComponentLink2URL: https://www.digikey.com/en/products/detail/susumu/RR0510R-100-D/432363; Composition: Thin Film; Device Package: 0402 (1005 Metric); Height - Seated (Max): 0.016" (0.40mm); LastUpdated: 2/9/2024 8:30:21 PM; Lifecycle Status: Active; Minimum Order: 1; Number of Terminations: 2; Operating Temperature: -55°C ~ 125°C; Package / Case: 0402 (1005 Metric); Packaging: TapeAndReel; PartId: 3233; Part Status: Active; Price: 0.01; Resistance: 10 Ohms; Series: RR; Size / Dimension: 0.039" L x 0.020" W (1.00mm x 0.50mm); Supplier 1: DigiKey; Supplier Part Number 1: RR05R10DCT-ND; Tolerance: ±0.5%
R12 R13 = RQ73C1E1K0BTD: RES 1 KOHMS 0.1% 1/16W 0402; Manufacturer: TE Connectivity Passive Product; Power (Watts): 0.063W, 1/16W; Resistance: 1 kOhms; Temperature Coefficient: ±10ppm/°C; Part Number: RQ73C1E1K0BTD; Value: 1 k; ComponentLink1Description: Datasheet; ComponentLink1URL: //media.digikey.com/pdf/Data%20Sheets/Tyco%20Electronics%20P%20B%20PDFs/RQ73-0618%20v2.pdf; ComponentLink2Description: DigiKey Link; ComponentLink2URL: https://www.digikey.com/en/products/detail/te-connectivity-passive-product/RQ73C1E1K0BTD/9479889; Composition: Thin Film; Device Package: 0402 (1005 Metric); Features: Anti-Sulfur, Automotive AEC-Q200; Height - Seated (Max): 0.016" (0.40mm); LastUpdated: 2/9/2024 8:30:21 PM; Lifecycle Status: Active; Minimum Order: 1; Number of Terminations: 2; Operating Temperature: -55°C ~ 155°C; Package / Case: 0402 (1005 Metric); Packaging: TapeAndReel; PartId: 3061; Part Status: Active; Price: 0.27; Ratings: AEC-Q200; Series: RQ73; Size / Dimension: 0.039" L x 0.020" W (1.00mm x 0.50mm); Supplier 1: DigiKey; Supplier Part Number 1: A139941CT-ND; Supplier Device Package: 0402; Tolerance: ±0.1%
R14 = RP73PF1E10KBTD: RES 10K OHM 0.1% 1/10W 0402; Manufacturer: TE Connectivity Passive Product; Power (Watts): 0.1W, 1/10W; Temperature Coefficient: ±25ppm/°C; Part Number: RP73PF1E10KBTD; Value: 10 kOhms; ComponentLink1Description: Datasheet; ComponentLink1URL: https://www.te.com/commerce/DocumentDelivery/DDEController?Action=srchrtrv&DocNm=1773272&DocType=DS&DocLang=English; ComponentLink2Description: DigiKey Link; ComponentLink2URL: https://www.digikey.com/en/products/detail/te-connectivity-passive-product/RP73PF1E10KBTD/8260957; Composition: Thin Film; Device Package: 0402 (1005 Metric); Height - Seated (Max): 0.014" (0.35mm); LastUpdated: 2/9/2024 8:30:24 PM; Lifecycle Status: Active; Minimum Order: 1; Number of Terminations: 2; Operating Temperature: -55°C ~ 155°C; Package / Case: 0402 (1005 Metric); Packaging: TapeAndReel; PartId: 2434; Part Status: Active; Price: 0.08; Resistance: 10 kOhms; Series: RP73, Holsworthy; Size / Dimension: 0.039" L x 0.020" W (1.00mm x 0.50mm); Supplier 1: DigiKey; Supplier Part Number 1: A127415CT-ND; Supplier Device Package: 0402; Tolerance: ±0.1%
R16 R17 = RQ73C1E1K0BTD: RES 1 KOHMS 0.1% 1/16W 0402; Manufacturer: TE Connectivity Passive Product; Power (Watts): 0.063W, 1/16W; Temperature Coefficient: ±10ppm/°C; Part Number: RQ73C1E1K0BTD; Value: 1 kOhms; ComponentLink1Description: Datasheet; ComponentLink1URL: //media.digikey.com/pdf/Data%20Sheets/Tyco%20Electronics%20P%20B%20PDFs/RQ73-0618%20v2.pdf; ComponentLink2Description: DigiKey Link; ComponentLink2URL: https://www.digikey.com/en/products/detail/te-connectivity-passive-product/RQ73C1E1K0BTD/9479889; Composition: Thin Film; Device Package: 0402 (1005 Metric); Features: Anti-Sulfur, Automotive AEC-Q200; Height - Seated (Max): 0.016" (0.40mm); LastUpdated: 2/9/2024 8:30:21 PM; Lifecycle Status: Active; Minimum Order: 1; Number of Terminations: 2; Operating Temperature: -55°C ~ 155°C; Package / Case: 0402 (1005 Metric); Packaging: TapeAndReel; PartId: 3061; Part Status: Active; Price: 0.27; Ratings: AEC-Q200; Resistance: 1 kOhms; Series: RQ73; Size / Dimension: 0.039" L x 0.020" W (1.00mm x 0.50mm); Supplier 1: DigiKey; Supplier Part Number 1: A139941CT-ND; Supplier Device Package: 0402; Tolerance: ±0.1%
R18-R20 = CPF0402B33RE: RES SMD 33 OHM 0.1% 1/16W 0402; Manufacturer: TE Connectivity Passive Product; Power (Watts): 0.063W, 1/16W; Temperature Coefficient: ±25ppm/°C; Part Number: CPF0402B33RE; Value: 33 Ohms; ComponentLink1Description: Datasheet; ComponentLink1URL: https://www.te.com/commerce/DocumentDelivery/DDEController?Action=srchrtrv&DocNm=1773200&DocType=DS&DocLang=English; ComponentLink2Description: DigiKey Link; ComponentLink2URL: https://www.digikey.com/en/products/detail/te-connectivity-passive-product/CPF0402B33RE/4966458; Composition: Thin Film; Device Package: 0402 (1005 Metric); Height - Seated (Max): 0.014" (0.35mm); LastUpdated: 2/9/2024 8:30:24 PM; Lifecycle Status: Active; Minimum Order: 1; Number of Terminations: 2; Operating Temperature: -55°C ~ 155°C; Package / Case: 0402 (1005 Metric); Packaging: TapeAndReel; PartId: 2485; Part Status: Active; Price: 0.10; Resistance: 33 Ohms; Series: CPF, Neohm; Size / Dimension: 0.039" L x 0.020" W (1.00mm x 0.50mm); Supplier 1: DigiKey; Supplier Part Number 1: A119938CT-ND; Supplier Device Package: 0402; Tolerance: ±0.1%
R21-R24 = SFR01MZPF49R9: RES 49.9 OHM 1% 1/16W 0402; Manufacturer: Rohm Semiconductor; Power (Watts): 0.063W, 1/16W; Resistance: 49.9 Ohms; Temperature Coefficient: ±100ppm/°C; Part Number: SFR01MZPF49R9; Value: 49.9R; ComponentLink1Description: Datasheet; ComponentLink1URL: https://www.rohm.com/datasheet/SFR01MZPF/sfr-e; ComponentLink2Description: DigiKey Link; ComponentLink2URL: https://www.digikey.com/en/products/detail/rohm-semiconductor/SFR01MZPF49R9/9771848; Composition: Thick Film; Device Package: 0402 (1005 Metric); Features: Anti-Sulfur; Height - Seated (Max): 0.016" (0.40mm); LastUpdated: 2/9/2024 8:30:22 PM; Lifecycle Status: Active; Minimum Order: 1; Number of Terminations: 2; Operating Temperature: -55°C ~ 155°C; Package / Case: 0402 (1005 Metric); Packaging: TapeAndReel; PartId: 2941; Part Status: Active; Price: 0.01; Series: SFR; Size / Dimension: 0.039" L x 0.020" W (1.00mm x 0.50mm); Supplier 1: DigiKey; Supplier Part Number 1: 511-1815-1-ND; Supplier Device Package: 0402; Tolerance: ±1%
R25 = RR0510R-100-D: RES SMD 10 OHM 0.5% 1/16W 0402; Manufacturer: Susumu; Power (Watts): 0.063W, 1/16W; Resistance: 10 Ohms; Temperature Coefficient: ±100ppm/°C; Part Number: RR0510R-100-D; Value: 10R; ComponentLink1Description: Datasheet; ComponentLink1URL: http://www.susumu.co.jp/common/pdf/n_catalog_partition05_en.pdf; ComponentLink2Description: DigiKey Link; ComponentLink2URL: https://www.digikey.com/en/products/detail/susumu/RR0510R-100-D/432363; Composition: Thin Film; Device Package: 0402 (1005 Metric); Height - Seated (Max): 0.016" (0.40mm); LastUpdated: 2/9/2024 8:30:21 PM; Lifecycle Status: Active; Minimum Order: 1; Number of Terminations: 2; Operating Temperature: -55°C ~ 125°C; Package / Case: 0402 (1005 Metric); Packaging: TapeAndReel; PartId: 3233; Part Status: Active; Price: 0.01; Series: RR; Size / Dimension: 0.039" L x 0.020" W (1.00mm x 0.50mm); Supplier 1: DigiKey; Supplier Part Number 1: RR05R10DCT-ND; Tolerance: ±0.5%
R26 = RR0510P-152-D: RES SMD 1.5K OHM 0.5% 1/16W 0402; Manufacturer: Susumu; Power (Watts): 0.063W, 1/16W; Resistance: 1.5 kOhms; Temperature Coefficient: ±25ppm/°C; Part Number: RR0510P-152-D; Value: 1.5 k; ComponentLink1Description: Datasheet; ComponentLink1URL: http://www.susumu.co.jp/common/pdf/n_catalog_partition05_en.pdf; ComponentLink2Description: DigiKey Link; ComponentLink2URL: https://www.digikey.com/en/products/detail/susumu/RR0510P-152-D/432401; Composition: Thin Film; Device Package: 0402 (1005 Metric); Height - Seated (Max): 0.016" (0.40mm); LastUpdated: 2/9/2024 8:30:21 PM; Lifecycle Status: Active; Minimum Order: 1; Number of Terminations: 2; Operating Temperature: -55°C ~ 125°C; Package / Case: 0402 (1005 Metric); Packaging: TapeAndReel; PartId: 3211; Part Status: Active; Price: 0.01; Series: RR; Size / Dimension: 0.039" L x 0.020" W (1.00mm x 0.50mm); Supplier 1: DigiKey; Supplier Part Number 1: RR05P1.5KDCT-ND; Tolerance: ±0.5%
R27 = RT0402FRE074K7L: RES SMD 4.7K OHM 1% 1/16W 0402; Manufacturer: Yageo; Power (Watts): 0.063W, 1/16W; Resistance: 4.7 kOhms; Temperature Coefficient: ±50ppm/°C; Part Number: RT0402FRE074K7L; Value: 4.7 k; ComponentLink1Description: Datasheet; ComponentLink1URL: https://www.yageo.com/upload/media/product/productsearch/datasheet/rchip/PYu-RT_1-to-0.01_RoHS_L_11.pdf; ComponentLink2Description: DigiKey Link; ComponentLink2URL: https://www.digikey.com/en/products/detail/yageo/RT0402FRE074K7L/1072052; Composition: Thin Film; Device Package: 0402 (1005 Metric); Height - Seated (Max): 0.014" (0.35mm); LastUpdated: 7/25/2024 9:18:18 AM; Lifecycle Status: Active; Minimum Order: 1; Number of Terminations: 2; Operating Temperature: -55°C ~ 155°C; Package / Case: 0402 (1005 Metric); Packaging: TapeAndReel; PartId: 3198; Part Status: Active; Price: 0.01; Series: RT; Size / Dimension: 0.039" L x 0.020" W (1.00mm x 0.50mm); Supplier 1: DigiKey; Supplier Part Number 1: YAG3347CT-ND; Supplier Device Package: 0402; Tolerance: ±1%
R28 R30 = CPF0402B330RE1: RES SMD 330 OHM 0.1% 1/16W 0402; Manufacturer: TE Connectivity Passive Product; Power (Watts): 0.063W, 1/16W; Temperature Coefficient: ±25ppm/°C; Part Number: CPF0402B330RE1; Value: 330 Ohms; ComponentLink1Description: Datasheet; ComponentLink1URL: https://www.te.com/commerce/DocumentDelivery/DDEController?Action=srchrtrv&DocNm=1773200&DocType=DS&DocLang=English; ComponentLink2Description: DigiKey Link; ComponentLink2URL: https://www.digikey.com/en/products/detail/te-connectivity-passive-product/CPF0402B330RE1/2381792; Composition: Thin Film; Device Package: 0402 (1005 Metric); Height - Seated (Max): 0.014" (0.35mm); LastUpdated: 2/9/2024 8:30:20 PM; Lifecycle Status: Active; Minimum Order: 1; Number of Terminations: 2; Operating Temperature: -55°C ~ 155°C; Package / Case: 0402 (1005 Metric); Packaging: TapeAndReel; PartId: 3357; Part Status: Active; Price: 0.13; Resistance: 330 Ohms; Series: CPF, Neohm; Size / Dimension: 0.039" L x 0.020" W (1.00mm x 0.50mm); Supplier 1: DigiKey; Supplier Part Number 1: A102797CT-ND; Supplier Device Package: 0402; Tolerance: ±0.1%
R33 = ERJ-2RKF1212X: RES SMD 12.1K OHM 1% 1/10W 0402; Manufacturer: Panasonic Electronic Components; Power (Watts): 0.1W, 1/10W; Temperature Coefficient: ±100ppm/°C; Part Number: ERJ-2RKF1212X; Value: 12.1 kOhms; ComponentLink1Description: Datasheet; ComponentLink1URL: https://industrial.panasonic.com/cdbs/www-data/pdf/RDA0000/AOA0000C304.pdf; ComponentLink2Description: DigiKey Link; ComponentLink2URL: https://www.digikey.com/en/products/detail/panasonic-electronic-components/ERJ-2RKF1212X/192105; Composition: Thick Film; Device Package: 0402 (1005 Metric); Features: Automotive AEC-Q200; Height - Seated (Max): 0.016" (0.40mm); LastUpdated: 2/9/2024 8:30:19 PM; Lifecycle Status: Active; Minimum Order: 1; Number of Terminations: 2; Operating Temperature: -55°C ~ 155°C; Package / Case: 0402 (1005 Metric); Packaging: CutTape; PartId: 3720; Part Status: Active; Price: 0.01; Ratings: AEC-Q200; Resistance: 12.1 kOhms; Series: ERJ-2RK; Size / Dimension: 0.039" L x 0.020" W (1.00mm x 0.50mm); Supplier 1: DigiKey; Supplier Part Number 1: P12.1KLCT-ND; Supplier Device Package: 0402; Tolerance: ±1%
RS1 TXD1 = 5973316507F: LED GREEN 0603 SMD; Manufacturer: Dialight; Configuration: Standard; Current - Test: 20mA; Lens Color: 1.24mm; Lens Style: Round with Domed Top; Millicandela Rating: 34mcd; Voltage - Forward (Vf) (Typ): 2V; Wavelength - Dominant: 560nm; Part Number: 5973316507F; Color: Green; ComponentLink1Description: Datasheet; ComponentLink1URL: http://www.dialightsignalsandcomponents.com/Assets/Drawings/2D_Drawings_DrawingDetailedSpec/NewDrawings/C18371C.pdf; ComponentLink2Description: DigiKey Link; ComponentLink2URL: https://www.digikey.com/en/products/detail/dialight/5973316507F/9385428; Device Package: 0603 (1608 Metric); Height (Max): 1.24mm; LastUpdated: 6/3/2024 7:58:53 PM; Lifecycle Status: Active; Minimum Order: 1; Mounting Type: Surface Mount; Package / Case: 0603 (1608 Metric); Packaging: TapeAndReel; PartId: 587; Part Status: Active; Price: 0.13; Series: 597; Size / Dimension: 1.60mm L x 0.80mm W; Supplier 1: DigiKey; Supplier Part Number 1: 350-4373-1-ND; Supplier Device Package: 0603; Value: Green
RS2 RXD1 = 5990040007F: LED YELLOW 0603 SMD; Manufacturer: Dialight; Configuration: Standard; Current - Test: 20mA; Lens Color: 0.80mm; Lens Size: 1.10mm x 0.80mm; Lens Style: Rectangle with Flat Top; Millicandela Rating: 105mcd; Viewing Angle: 140°; Voltage - Forward (Vf) (Typ): 2.1V; Wavelength - Dominant: 590nm; Part Number: 5990040007F; Color: Yellow; ComponentLink1Description: Datasheet; ComponentLink1URL: http://www.dialightsignalsandcomponents.com/Assets/Brochures_And_Catalogs/Indication/CBI_SMD_new/Dialight_CBI_data_599-0603_Apr2018.pdf; ComponentLink2Description: DigiKey Link; ComponentLink2URL: https://www.digikey.com/en/products/detail/dialight/5990040007F/9385404; Device Package: 0603 (1608 Metric); Height (Max): 0.80mm; LastUpdated: 6/3/2024 8:01:10 PM; Lifecycle Status: Active; Minimum Order: 1; Mounting Type: Surface Mount; Package / Case: 0603 (1608 Metric); Packaging: TapeAndReel; PartId: 83; Part Status: Active; Price: 0.04; Series: 599; Size / Dimension: 1.60mm L x 0.80mm W; Supplier 1: DigiKey; Supplier Part Number 1: 350-4349-1-ND; Supplier Device Package: 0603; Value: Yellow
RST1 = DTSM-3: Tactile Switch SMD SPST; Manufacturer: Diptronics; Manufacturer Part Number: DTSM-3
U1 U4 = BU33SD5WG-TR: LDO Voltage Regulator 3.3V 500mA; Manufacturer: ROHM Semiconductor; Manufacturer Part Number: BU33SD5WG-TR
U2 = ESP32-C3: Ultra­Low­Power SoC with RISC­V Single­Core CPU Supporting IEEE 802.11b/g/n (2.4 GHz Wi­Fi) and Bluetooth® 5 (LE); Manufacturer: Espressif; Manufacturer Part Number: ESP32-C3; LCSC: C2838500
U3 = CMP-06315-000013-1: IC FLASH 16M SPI 104MHZ 8SOIC; Page Size: 256B; Density: 16Mb; Interface: SPI; Memory Type: FLASH; Frequency: 104MHz; Max Operating Temperature: 85°C; Number of Pins: 8; RoHS Compliant: Yes; Min Operating Temperature: -40°C; Case/Package: SOIC; Packaging: Tape and Reel
U5 = CMP-0299-00150-2: Dual EIA-232 Driver / Receiver, 0 to 70 degC, 16-Pin SOIC (D), Green (RoHS & no Sb/Br); Single Supply: TRUE; Supply Voltage(s)(V): 5; SubFamily: RS-232; Drivers Per Package: 2; ICC(Max)(mA): 10; ESD HBM(kV): +/-2; ComponentLink1Description: Manufacturer URL; ComponentLink2Description: Datasheet; RS-232: TRUE; ComponentLink3URL: http://www.ti.com/litv/pdf/mpds178g; DatasheetVersion: SLLS047L; ComponentLink1URL: www.ti.com; PackageDescription: 16-Pin Plastic Small Outline Integrated Circuit, 9.9 x 3.9 mm, Pitch 1.27 mm Pitch; PackageVersion: revM, Jun-2011; ComponentLink2URL: http://www.ti.com/general/docs/lit/getliterature.tsp?genericPartNumber=MAX232&fileType=pdf; ComponentLink3Description: Package Specification; PackageReference: D0016A; Receivers Per Package: 2
U6 = CMP-06281-000046-1: IC TRANSCEIVER FULL 2/2 24SQFN; Simplex/Duplex: Full Duplex; Min Supply Voltage: 1.14V; Data Rate: 100Mbps; Max Supply Current: 21mA; Operating Supply Voltage: 1.2V; Number of Transceivers: 1; Max Supply Voltage: 1.26V; Mount: Surface Mount; Packaging: Tape and Reel; Max Operating Temperature: 85°C; RoHS Compliant: Yes; Min Operating Temperature: -40°C; Number of Pins: 24; Weight: 0.032741oz; Package Quantity: 5000; Case/Package: QFN
UART1 = CMP-2000-05238-1: Male Header, Pitch 1.25 mm, 1 x 4 Position, Height 3.4 mm, -40 to 85 degC, RoHS, Tape and Reel; Current Rating: 1A; Brand: Molex; Number of Positions / Contacts: 4; Pitch: 1.25mm; Voltage Rating: 125V; Mounting Angle: Right; Manufacturer URL: http://www.molex.com/; Factory Pack Quantity: 1000; Housing Material: Thermoplastic; Datasheet URL: http://www.molex.com/pdm_docs/sd/532610471_sd.pdf; Tradename: PicoBlade; Product Type: Headers; Contact Plating: Tin; Contact Material: PhosphorBronze; Package Description: 1.25mm Pitch PicoBlade(TM) Header, Surface Mount, Right Angle, Lead-Free, 4 Circuits; Mounting Style: SMD/SMT; Manufacturer: Molex; Series: 53261; Packaging: Reel; Number of Rows: 1; RoHS: Details; Number of Positions: 4; Product Category: Headers&WireHousings; Datasheet Version: Rev. G, 01/2012; Type: Shrouded; Termination Style: SMD
Y1 = CMP-18717-000452-1: Crystal 40MHz, 10ppm, 10pF, 50Ω; ESR (Equivalent Series Resistance): 60R; Lead Free: Lead Free; Frequency Tolerance: 10ppm; Width: 2.5mm; Depth: 2.5mm; Frequency Stability: 10ppm; Length: 0.126inch; Height: 0.031inch; Max Operating Temperature: 70°C; Load Capacitance: 10pF; Packaging: Tape and Reel; Series: 7M; Min Operating Temperature: -10°C; Mount: Surface Mount; Package Quantity: 1; REACH SVHC: No SVHC; Frequency: 40MHz; Termination: SMD/SMT; Case/Package: SMD/SMT; Tolerance: 10ppm
Y2 = CMP-27762-004169-1: XTAL Oscillator 50MHz ±25ppm CMOS 3.3V 4-SMD 3.2mm x 2.5mm; Max Supply Voltage: 3.465V; Min Supply Voltage: 3.135V; Max Supply Current: 19mA; Load Capacitance: 15pF; Width: 0.098inch; Min Operating Temperature: -40°C; Number of Pins: 4; Frequency: 50MHz; Case/Package: SMD/SMT; REACH SVHC: No SVHC; Height: 0.047inch; Frequency Stability: 25ppm; Mount: Surface Mount; Package Quantity: 1000; Operating Supply Voltage: 3.3V; Max Operating Temperature: 85°C; Packaging: Tape and Reel; Length: 0.126inch; Series: ASE